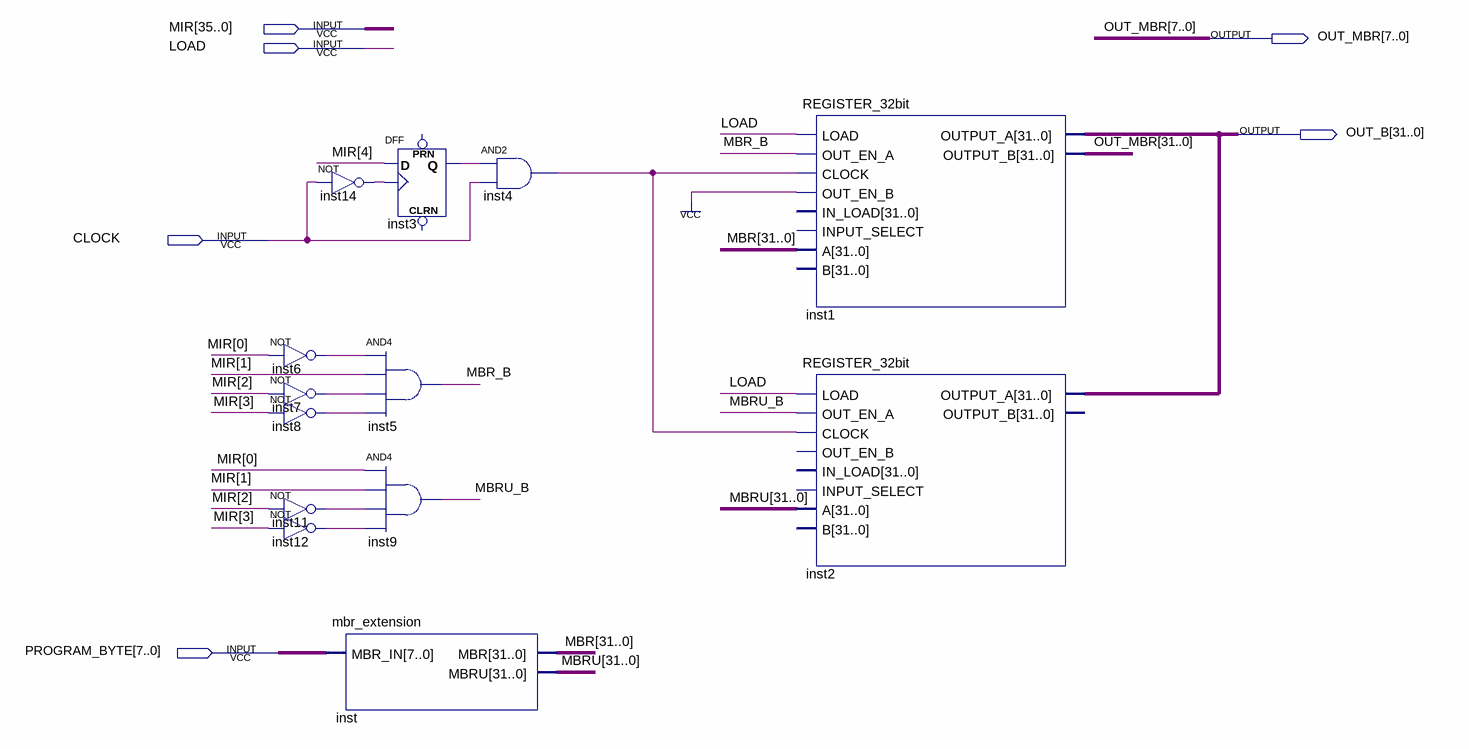
[diagram p0: schematic sheet]
// Quartus schematic MBR.bdf as structural Verilog: 13 symbols, 6 pins
module MBR (
  input  [35:0] MIR,
  input  LOAD,
  input  CLOCK,
  input  [7:0] PROGRAM_BYTE,
  output [31:0] OUT_MBR,
  output [31:0] OUT_B
);

  wire inst3_q, inst4_out, inst6_out, inst7_out, inst8_out, inst11_out, inst12_out, inst14_out, MBR_B, MBRU_B;
  wire [31:0] MBR, MBRU;

  not inst6 (inst6_out, MIR[0]);
  not inst7 (inst7_out, MIR[2]);
  not inst8 (inst8_out, MIR[3]);
  not inst11 (inst11_out, MIR[2]);
  not inst12 (inst12_out, MIR[3]);
  not inst14 (inst14_out, CLOCK);
  and inst5 (MBR_B, inst6_out, MIR[1], inst7_out, inst8_out);
  and inst9 (MBRU_B, MIR[0], MIR[1], inst11_out, inst12_out);
  mbr_extension inst (.MBR_IN(PROGRAM_BYTE), .MBR(MBR), .MBRU(MBRU));
  DFF inst3 (.CLK(inst14_out), .D(MIR[4]), .Q(inst3_q));  // open: CLRN, PRN
  and inst4 (inst4_out, inst3_q, CLOCK);
  REGISTER_32bit inst1 (
    .LOAD(LOAD), .OUT_EN_A(MBR_B), .CLOCK(inst4_out), .OUT_EN_B(1'b1), .A(MBR), .OUTPUT_A(OUT_B),
    .OUTPUT_B(OUT_MBR));  // open: IN_LOAD, INPUT_SELECT, B
  REGISTER_32bit inst2 (
    .LOAD(LOAD), .OUT_EN_A(MBRU_B), .CLOCK(inst4_out), .A(MBRU), .OUTPUT_A(OUT_B));  // open: OUT_EN_B, IN_LOAD, INPUT_SELECT, B, OUTPUT_B
endmodule
